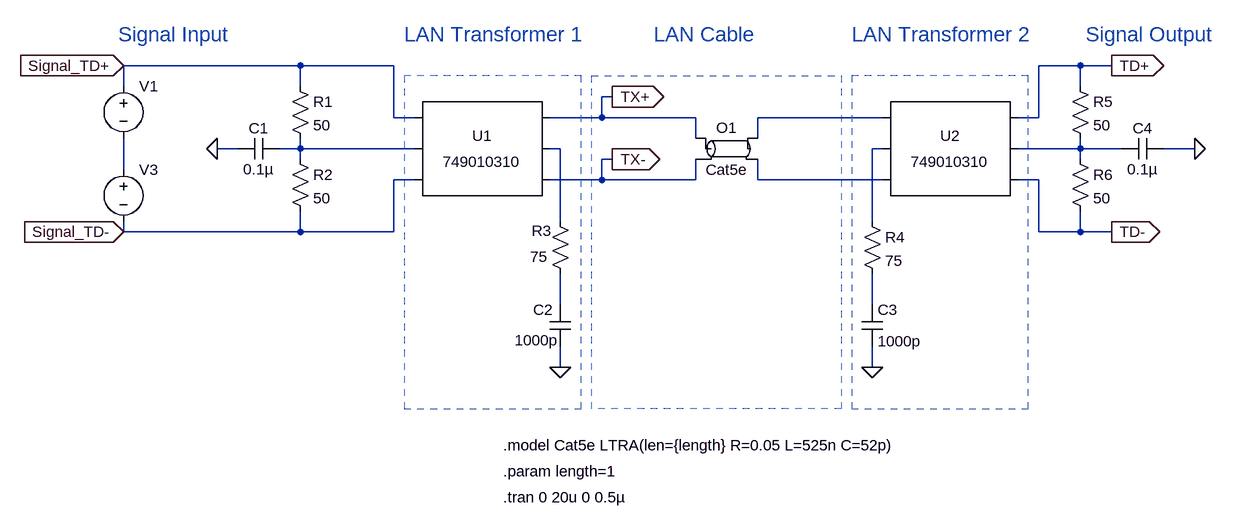
[diagram p0: schematic Transient_simulation_Transmission_line.asc]
Transient_simulation_Transmission_line.asc, the LTspice schematic file:
Version 4
SHEET 1 2244 888
WIRE -16 -48 -288 -48
WIRE 128 -48 -16 -48
WIRE 1184 -48 1120 -48
WIRE 1232 -48 1184 -48
WIRE -288 -16 -288 -48
WIRE -16 -16 -16 -48
WIRE 1184 -16 1184 -48
WIRE 464 0 448 0
WIRE 128 32 128 -48
WIRE 160 32 128 32
WIRE 448 32 448 0
WIRE 448 32 368 32
WIRE 592 32 448 32
WIRE 880 32 688 32
WIRE 1120 32 1120 -48
WIRE 1120 32 1088 32
WIRE 592 64 592 32
WIRE 688 64 688 32
WIRE -112 80 -144 80
WIRE -16 80 -16 64
WIRE -16 80 -48 80
WIRE 160 80 -16 80
WIRE 384 80 368 80
WIRE 880 80 864 80
WIRE 1184 80 1184 64
WIRE 1184 80 1088 80
WIRE 1248 80 1184 80
WIRE 1360 80 1312 80
WIRE -16 96 -16 80
WIRE 464 96 448 96
WIRE 1184 96 1184 80
WIRE -288 112 -288 64
WIRE 160 128 128 128
WIRE 448 128 448 96
WIRE 448 128 368 128
WIRE 592 128 592 96
WIRE 592 128 448 128
WIRE 688 128 688 96
WIRE 880 128 688 128
WIRE 1120 128 1088 128
WIRE 384 192 384 80
WIRE 864 192 864 80
WIRE -288 208 -288 192
WIRE -16 208 -16 176
WIRE -16 208 -288 208
WIRE 128 208 128 128
WIRE 128 208 -16 208
WIRE 1120 208 1120 128
WIRE 1184 208 1184 176
WIRE 1184 208 1120 208
WIRE 1232 208 1184 208
WIRE 384 320 384 272
WIRE 864 320 864 272
WIRE 384 416 384 384
WIRE 864 416 864 384
WIRE 0 0 0 0
FLAG 384 416 0
FLAG 864 416 0
FLAG 1360 80 0
FLAG -144 80 0
FLAG -288 -48 Signal_TD+
IOPIN -288 -48 In
FLAG -288 208 Signal_TD-
IOPIN -288 208 In
FLAG 464 0 TX+
IOPIN 464 0 Out
FLAG 464 96 TX-
IOPIN 464 96 Out
FLAG 1232 -48 TD+
IOPIN 1232 -48 Out
FLAG 1232 208 TD-
IOPIN 1232 208 Out
SYMBOL cap 368 320 R0
WINDOW 0 -26 8 Left 2
WINDOW 3 -54 55 Left 2
SYMATTR InstName C2
SYMATTR Value 1000p
SYMBOL res 368 176 R0
WINDOW 0 -28 30 Left 2
WINDOW 3 -30 70 Left 2
SYMATTR InstName R3
SYMATTR Value 75
SYMBOL cap 848 320 R0
SYMATTR InstName C3
SYMATTR Value 1000p
SYMBOL res 848 176 R0
SYMATTR InstName R4
SYMATTR Value 75
SYMBOL cap 1248 96 R270
WINDOW 0 32 32 VTop 2
WINDOW 3 0 32 VBottom 2
SYMATTR InstName C4
SYMATTR Value 0.1µ
SYMBOL res -32 -32 R0
SYMATTR InstName R1
SYMATTR Value 50
SYMBOL res -32 80 R0
SYMATTR InstName R2
SYMATTR Value 50
SYMBOL res 1168 -32 R0
SYMATTR InstName R5
SYMATTR Value 50
SYMBOL res 1168 80 R0
SYMATTR InstName R6
SYMATTR Value 50
SYMBOL cap -48 64 R90
WINDOW 0 0 32 VBottom 2
WINDOW 3 32 32 VTop 2
SYMATTR InstName C1
SYMATTR Value 0.1µ
SYMBOL voltage -288 -32 R0
WINDOW 123 24 152 Left 2
WINDOW 39 24 44 Left 2
WINDOW 3 24 96 Invisible 2
SYMATTR Value PWL file=Signal_1.txt
SYMATTR InstName V1
SYMBOL ltline 640 80 R0
SYMATTR InstName O1
SYMATTR Value Cat5e
SYMBOL voltage -288 96 R0
WINDOW 123 24 152 Left 2
WINDOW 39 24 44 Left 2
WINDOW 3 24 96 Invisible 2
SYMATTR Value PWL file=Signal_1.txt
SYMATTR InstName V3
SYMBOL Wurth_Elektronik\\Signal&Communications\\WE-LANAQ 304 80 R0
SYMATTR InstName U1
SYMBOL Wurth_Elektronik\\Signal&Communications\\WE-LANAQ 1024 80 R0
SYMATTR InstName U2
TEXT 296 616 Left 2 !.tran 0 20u 0 0.5µ
TEXT 528 -96 Left 3 ;LAN Cable
TEXT 144 -96 Left 3 ;LAN Transformer 1
TEXT 832 -96 Left 3 ;LAN Transformer 2
TEXT -296 -96 Left 3 ;Signal Input
TEXT 1192 -96 Left 3 ;Signal Output
TEXT 296 536 Left 2 !.model Cat5e LTRA(len={length} R=0.05 L=525n C=52p)
TEXT 296 576 Left 2 !.param length=1
RECTANGLE Normal 144 480 416 -32 2
RECTANGLE Normal 832 480 1104 -32 2
RECTANGLE Normal 816 480 432 -32 2

The netlist it stands for:
* Transient_simulation_Transmission_line.asc
C2 N008 0 1000p
R3 N003 N008 75
C3 N009 0 1000p
R4 N004 N009 75
C4 N005 0 0.1µ
R1 Signal_TD+ N002 50
R2 N002 Signal_TD- 50
R5 TD+ N005 50
R6 N005 TD- 50
C1 N002 0 0.1µ
V1 Signal_TD+ N006 PWL file=Signal_1.txt
O1 TX+ TX- N001 N007 Cat5e
V3 N006 Signal_TD- PWL file=Signal_1.txt
XU1 Signal_TD+ N002 Signal_TD- TX- N003 TX+ 749010310
XU2 N001 N004 N007 TD- N005 TD+ 749010310
.tran 0 20u 0 0.5µ
* LAN Cable
* LAN Transformer 1
* LAN Transformer 2
* Signal Input
* Signal Output
.model Cat5e LTRA(len={length} R=0.05 L=525n C=52p)
.param length=1
.lib WE-LANAQ.lib
.backanno
.end